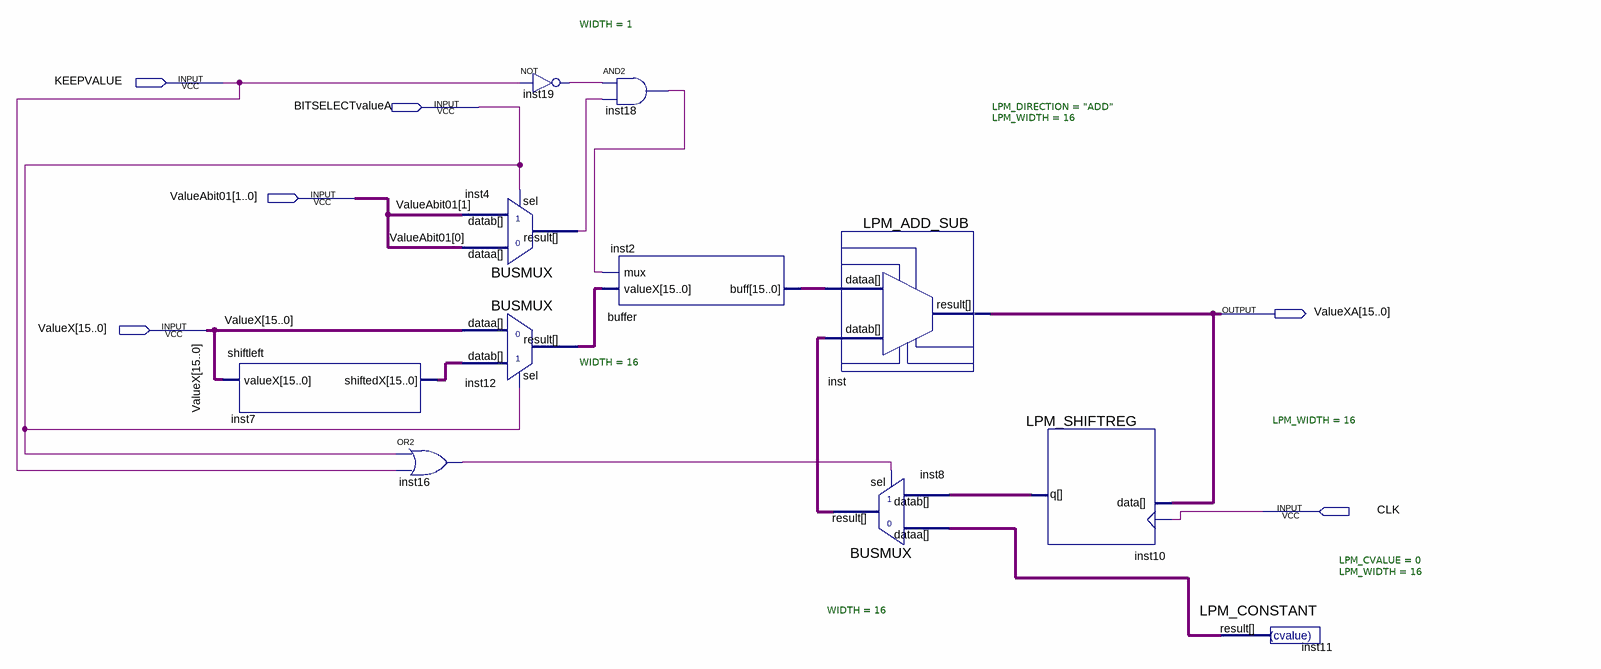
[diagram p0: schematic sheet]
// Quartus schematic multiply.bdf as structural Verilog: 11 symbols, 6 pins
module multiply (
  input  KEEPVALUE,
  input  BITSELECTvalueA,
  input  [1:0] ValueAbit01,
  input  [15:0] ValueX,
  input  CLK,
  output [15:0] ValueXA
);

  wire inst4_result, inst16_out, inst18_out, inst19_out;
  wire [15:0] inst2_buff, inst7_shiftedx, inst8_result, inst10_q, inst11_result, inst12_result;

  shiftleft inst7 (.valueX(ValueX), .shiftedX(inst7_shiftedx));
  or inst16 (inst16_out, BITSELECTvalueA, KEEPVALUE);
  not inst19 (inst19_out, KEEPVALUE);
  BUSMUX #(.WIDTH(1)) inst4 (
    .datab(ValueAbit01[1]), .sel(BITSELECTvalueA), .dataa(ValueAbit01[0]), .result(inst4_result));
  BUSMUX #(.WIDTH(16)) inst12 (.datab(inst7_shiftedx), .sel(BITSELECTvalueA), .dataa(ValueX), .result(inst12_result));
  and inst18 (inst18_out, inst19_out, inst4_result);
  buffer inst2 (.valueX(inst12_result), .mux(inst18_out), .buff(inst2_buff));
  LPM_ADD_SUB #(.LPM_DIRECTION("ADD"), .LPM_WIDTH(16)) inst (
    .dataa(inst2_buff), .datab(inst8_result), .result(ValueXA));
  BUSMUX #(.WIDTH(16)) inst8 (.datab(inst10_q), .sel(inst16_out), .dataa(inst11_result), .result(inst8_result));
  LPM_SHIFTREG #(.LPM_WIDTH(16)) inst10 (.clock(CLK), .data(ValueXA), .q(inst10_q));
  LPM_CONSTANT #(.LPM_CVALUE(0), .LPM_WIDTH(16)) inst11 (.result(inst11_result));
endmodule
